# Altium schematic sheet mainboard_rs485.v1.5.SchDoc
size A4
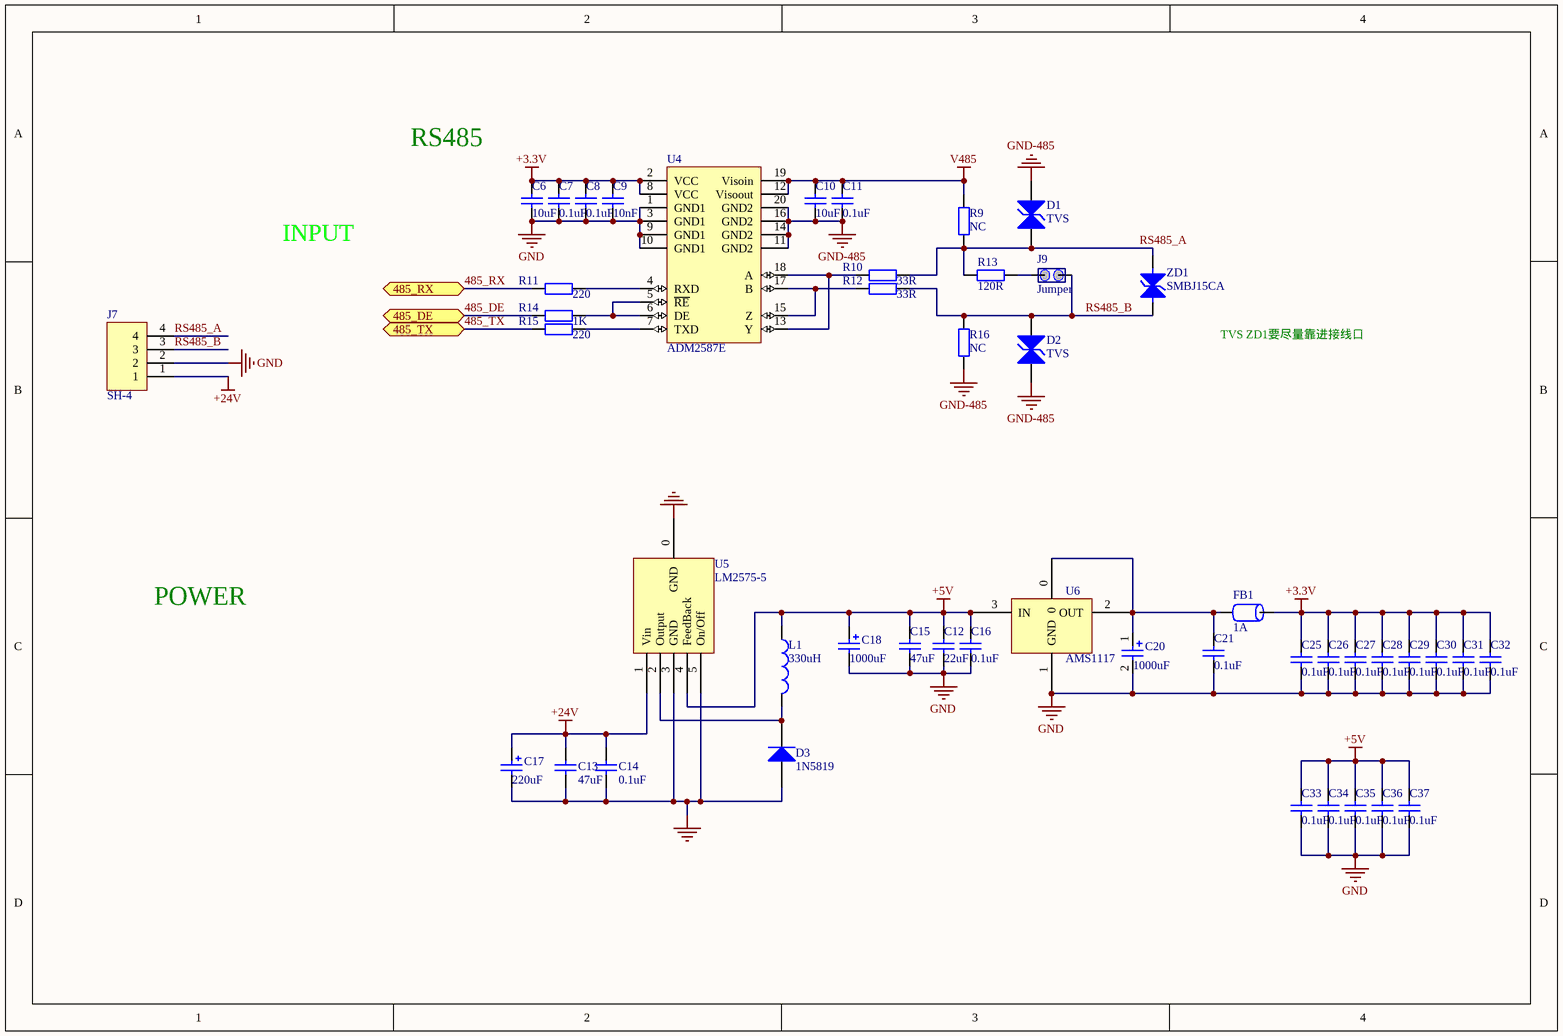
[diagram p0: mainboard_rs485.v1.5.SchDoc]

## Parts
C6  10uF  [0805]
C7  0.1uF  [0805]
C8  0.1uF  [0805]
C9  10nF  [0805]
C10  10uF  [0805]
C11  0.1uF  [0805]
C12  22uF  [1206]
C13  47uF  [1812]
C14  0.1uF  [0805]
C15  47uF  [1812]
C16  0.1uF  [0805]
C17  220uF  [CAP-5mm]
C18  1000uF  [CAP_SMT_10X10]
C20  1000uF  [CAP_SMT_10X10]
C21  0.1uF  [0805]
C25  0.1uF  [0805]
C26  0.1uF  [0805]
C27  0.1uF  [0805]
C28  0.1uF  [0805]
C29  0.1uF  [0805]
C30  0.1uF  [0805]
C31  0.1uF  [0805]
C32  0.1uF  [0805]
C33  0.1uF  [0805]
C34  0.1uF  [0805]
C35  0.1uF  [0805]
C36  0.1uF  [0805]
C37  0.1uF  [0805]
D1  TVS  [SMBJ_DO-214]
D2  TVS  [SMBJ_DO-214]
D3  1N5819  [Diode_TP2]
FB1  1A  [0805]
J7  SH-4  [PWR]
J9  Jumper  [J254-2]
L1  value 330uH  [Inductance]  (hidden comment: Inductor)
R9  NC  [0805]
R10  33R  [0805]
R11  220  [0805]
R12  33R  [0805]
R13  120R  [0805]
R14  1K  [0805]
R15  220  [0805]
R16  NC  [0805]
U4  ADM2587E  [SOIC_W_20]
U5  LM2575-5  [TO-263]
U6  AMS1117  [TO-223]
ZD1  SMBJ15CA  [DO-214AA/SMB]

## Ports
485_DE, 485_RX, 485_TX

## Nets
+3.3V: C6.2 C7.2 C8.2 C9.2 C25.2 C26.2 C27.2 C28.2 C29.2 C30.2 C31.2 C32.2 FB1.2 U4.2(VCC) U4.8(VCC)
+5V: C12.2 C15.2 C16.2 C18.1 C33.2 C34.2 C35.2 C36.2 C37.2 L1.1 U5.4(FeedBack) U6.3(IN)
+24V: C13.2 C14.2 C17.1 J7.1 U5.1(Vin)
GND: C6.1 C7.1 C8.1 C9.1 C12.1 C13.1 C14.1 C15.1 C16.1 C17.2 C18.2 C20.2 C21.1 C25.1 C26.1 C27.1 C28.1 C29.1 C30.1 C31.1 C32.1 C33.1 C34.1 C35.1 C36.1 C37.1 D3.1(A) J7.2 U4.1(GND1) U4.3(GND1) U4.9(GND1) U4.10(GND1) U5.0(GND) U5.3(GND) U5.5(On/Off) U6.1(GND)
GND-485: C10.1 C11.1 D1.1(A) D2.1(A) R16.1 U4.11(GND2) U4.14(GND2) U4.16(GND2) U4.20(GND2)
V485: C10.2 C11.2 R9.2 U4.12(Visoout) U4.19(Visoin)
485_DE: R14.1 ; port 485_DE
485_RX: R11.1 ; port 485_RX
485_TX: R15.1 ; port 485_TX
RS485_A: D1.2(K) J7.4 R9.1 R10.2 R13.2 ZD1.1
RS485_B: D2.2(K) J7.3 J9.1 R12.2 R16.2 ZD1.2
NetC20_1: C20.1 C21.2 FB1.1 U6.0 U6.2(OUT)
NetD3_2: D3.2(K) L1.2 U5.2(Output)
NetJ9_2: J9.2 R13.1
NetR10_1: R10.1 U4.13(Y) U4.18(A)
NetR11_2: R11.2 U4.4(RXD)
NetR12_1: R12.1 U4.15(Z) U4.17(B)
NetR14_2: R14.2 U4.5(~{RE}) U4.6(DE)
NetR15_2: R15.2 U4.7(TXD)

## Notes on the sheet
- RS485
- INPUT
- (near ZD1) TVS ZD1要尽量靠进接线口
- POWER

## Library data of the parts
C6-C11 = Cap: Capacitor; Value: 100pF; Published: 8-Jun-2000; LatestRevisionDate: 17-Jul-2002; LatestRevisionNote: Re-released for DXP Platform.; PackageReference: RAD-0.3; Publisher: Altium Limited
C12 C15 C16 C21 C25-C37 = Cap0805
C13 C14 = Cap: Capacitor; Published: 8-Jun-2000; Revision: July-2002: Re-released for DXP Platform.; Publisher: Altium Limited
C17 = Cap Pol1: Polarized Capacitor (Radial); Published: 8-Jun-2000; Revision: July-2002: Re-released for DXP Platform.; Publisher: Altium Limited; Value: 220uf
C18 C20 = Cap Pol1: Polarized Capacitor (Radial); Value: 220uf; Published: 8-Jun-2000; Revision: July-2002: Re-released for DXP Platform.; Publisher: Altium Limited
D3 = Diode 1N4148: High Conductance Fast Diode; Revision 1: 11-Jul-2000: SIM Model Added.; Revision 2: 17-Jul-2002: Re-released for DXP Platform.; Code - JEDEC: DO-204-AH; Published: 8-Jun-2000; Datasheet: Latest Revision: 1997; Package Reference: DO-35; Publisher: Altium Limited
FB1 = FERRITE
R9-R13 R15 R16 = Res2: Resistor; Value: 1K; Published: 8-Jun-2000; LatestRevisionDate: 17-Jul-2002; LatestRevisionNote: Re-released for DXP Platform.; PackageReference: AXIAL-0.4; Publisher: Altium Limited
R14 = Res2: Resistor; Published: 8-Jun-2000; LatestRevisionDate: 17-Jul-2002; LatestRevisionNote: Re-released for DXP Platform.; PackageReference: AXIAL-0.4; Publisher: Altium Limited; Value: 1K
U4 = ADM2587E: isolated DC-DC RS485
U5 = LM25XX
ZD1 = TVS: 瞬态抑制二极管
D1 D2 = TVS: Published: 8-Jun-2000; LatestRevisionDate: 17-Jul-2002; LatestRevisionNote: Re-released for DXP Platform.; PackageReference: DIODE-0.7; Publisher: Altium Limited
L1 = Inductor: Published: 8-Jun-2000; Revision: July-2002: Re-released for DXP Platform.; Publisher: Altium Limited